# Altium project LV control.PrjPcb
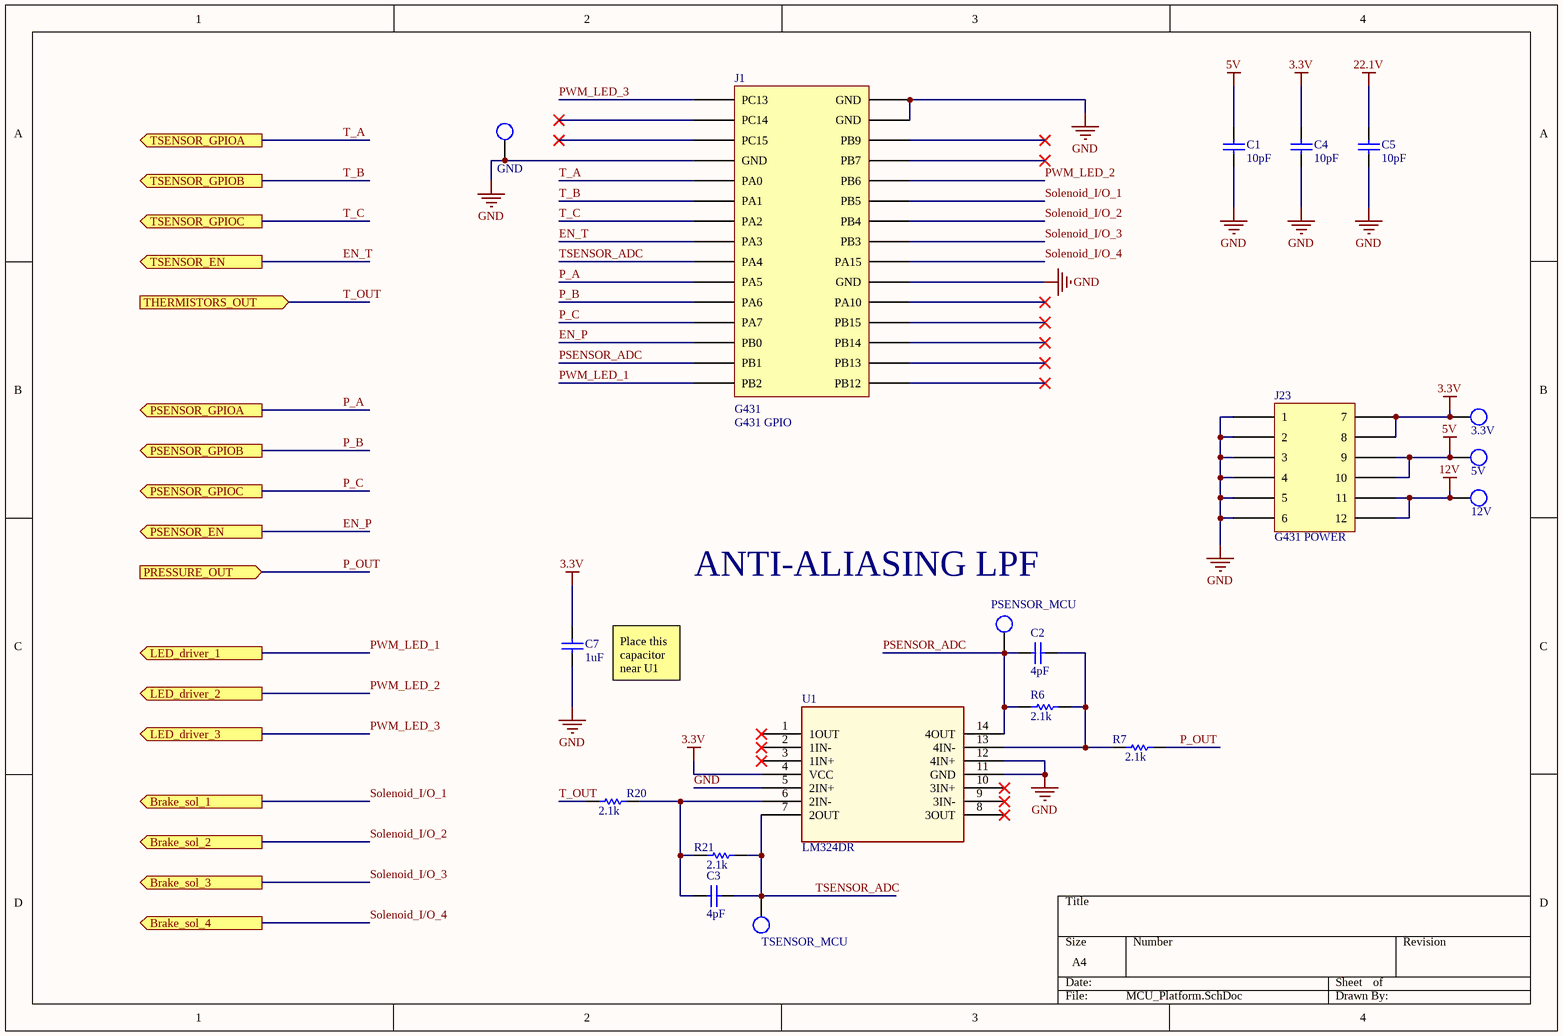
[diagram p0: MCU_Platform.SchDoc]
5 sheets, 71 parts. Net scope: flat (ports and power ports of the same name join across sheets).
Board file: LV control.PcbDoc
Sheets:
  MCU_Platform.SchDoc
  PressureSensors.SchDoc
  Thermistors.SchDoc
  LED_Driver.SchDoc
  Braking.SchDoc

## Sheet MCU_Platform.SchDoc
size A4; SheetNumber: 1; SheetTotal: 5

### Parts
3.3V  Test Point  [Test Point - 5002]  (value not drawn)  (no BOM)
5V  Test Point  [Test Point - 5002]  (value not drawn)  (no BOM)
12V  Test Point  [Test Point - 5002]  (value not drawn)  (no BOM)
C1  value 10pF  [0603 - Capacitor]  (hidden comment: Capacitor - Nonpolarized)
C2  value 4pF  [0603 - Capacitor]  (hidden comment: Capacitor - Nonpolarized)
C3  value 4pF  [0603 - Capacitor]  (hidden comment: Capacitor - Nonpolarized)
C4  value 10pF  [0603 - Capacitor]  (hidden comment: Capacitor - Nonpolarized)
C5  value 10pF  [0603 - Capacitor]  (hidden comment: Capacitor - Nonpolarized)
C7  value 1uF  [0603 - Capacitor]  (hidden comment: Capacitor - Nonpolarized)
GND  Test Point  [Test Point - 5002]  (value not drawn)  (no BOM)
J1  G431 GPIO  [G431 Header (GPIO Connector)]
J23  G431 POWER  [G431 HEADER (POWER CONNECTOR)]
PSENSOR_MCU  Test Point  [Test Point - 5002]  (value not drawn)  (no BOM)
R6  value 2.1k  [0805 - Resistor]  (hidden comment: Resistor)
R7  value 2.1k  [0805 - Resistor]  (hidden comment: Resistor)
R20  value 2.1k  [0805 - Resistor]  (hidden comment: Resistor)
R21  value 2.1k  [0805 - Resistor]  (hidden comment: Resistor)
TSENSOR_MCU  Test Point  [Test Point - 5002]  (value not drawn)  (no BOM)
U1  LM324DR  [LM324DR]

### Ports
Brake_sol_1 (out), Brake_sol_2 (out), Brake_sol_3 (out), Brake_sol_4 (out), LED_driver_1 (out), LED_driver_2 (out), LED_driver_3 (out), PRESSURE_OUT (in), PSENSOR_EN (out), PSENSOR_GPIOA (out), PSENSOR_GPIOB (out), PSENSOR_GPIOC (out), THERMISTORS_OUT (in), TSENSOR_EN (out), TSENSOR_GPIOA (out), TSENSOR_GPIOB (out), TSENSOR_GPIOC (out)

### Nets
3.3V: 3.3V.1 C4.2 C7.2 J23.7 J23.8 U1.4(VCC)
5V: 5V.1 C1.2 J23.9 J23.10
12V: 12V.1 J23.11 J23.12
22.1V: C5.2
GND: C1.1 C4.1 C5.1 C7.1 GND.1 J1.4(GND) J1.16(GND) J1.17(GND) J1.25(GND) J23.1 J23.2 J23.3 J23.4 J23.5 J23.6 U1.5(2IN+) U1.11(GND) U1.12(4IN+)
EN_P: J1.13(PB0) ; port PSENSOR_EN
EN_T: J1.8(PA3) ; port TSENSOR_EN
P_A: J1.10(PA5) ; port PSENSOR_GPIOA
P_B: J1.11(PA6) ; port PSENSOR_GPIOB
P_C: J1.12(PA7) ; port PSENSOR_GPIOC
P_OUT: R7.2 ; port PRESSURE_OUT
PSENSOR_ADC: C2.1 J1.14(PB1) PSENSOR_MCU.1 R6.1 U1.14(4OUT)
PWM_LED_1: J1.15(PB2) ; port LED_driver_1
PWM_LED_2: J1.20(PB6) ; port LED_driver_2
PWM_LED_3: J1.1(PC13) ; port LED_driver_3
Solenoid_I/O_1: J1.21(PB5) ; port Brake_sol_1  [project net SOL_MCU_1]
Solenoid_I/O_2: J1.22(PB4) ; port Brake_sol_2  [project net SOL_MCU_2]
Solenoid_I/O_3: J1.23(PB3) ; port Brake_sol_3  [project net SOL_MCU_3]
Solenoid_I/O_4: J1.24(PA15) ; port Brake_sol_4  [project net SOL_MCU_4]
T_A: J1.5(PA0) ; port TSENSOR_GPIOA
T_B: J1.6(PA1) ; port TSENSOR_GPIOB
T_C: J1.7(PA2) ; port TSENSOR_GPIOC
T_OUT: R20.1 ; port THERMISTORS_OUT
TSENSOR_ADC: C3.1 J1.9(PA4) R21.2 TSENSOR_MCU.1 U1.7(2OUT)
NetC2_2: C2.2 R6.2 R7.1 U1.13(4IN-)
NetC3_2: C3.2 R20.2 R21.1 U1.6(2IN-)

Not connected (* = marked no-connect by the designer): J1 2(PC14)* 3(PC15)* 18(PB9)* 19(PB7)* 26(PA10)* 27(PB15)* 28(PB14)* 29(PB13)* 30(PB12)*; U1 1(1OUT)* 2(1IN-)* 3(1IN+)* 8(3OUT)* 9(3IN-)* 10(3IN+)*

### Notes on the sheet
- ANTI-ALIASING LPF
- (near C7) Place this capacitor near U1
- (in symbol G431 GPIO) G431

### Library data of the parts
C1-C5 C7 = Capacitor - Nonpolarized: Nonpolarized Capacitor; Supplier Part Number: *; Supplier: *; Manufacturer: *; Rating: *; Manufacturer Part Number: *
J1 = G431 GPIO: PPPC152LJBN-RC (30 Position Header Connector 0.100" (2.54mm) Through Hole, Right Angle Gold); Manufacturer Name: Sullins Connector Solutions; Manufacturer Part Number (CONN): PPPC152LJBN-RC; Supplier Name: Digikey; Supplier Part Number: S5568-ND
J23 = G431 POWER: PPPC062LJBN-RC (12 Position Header Connector 0.100" (2.54mm) Through Hole, Right Angle Gold); Manufacturer Name: Sullins Connector Solutions; Manufacturer Part Number: PPPC062LJBN-RC; Supplier Name: Digikey; Supplier Part Number: S5559-ND
U1 = LM324DR: General Purpose Amplifier 4 Circuit 14-SOIC; Manufacturer Name: TI; Manufacturer Part Number: LM324DR; Supplier: Digikey; Supplier Part Number: 296-14597-2-ND
R6 R7 R20 R21 = Resistor: Rating: *; Manufacturer Part Number: *; Manufacturer: *; Supplier Part Number: *; Supplier: *

## Sheet PressureSensors.SchDoc
size A4; SheetNumber: 2; SheetTotal: 5
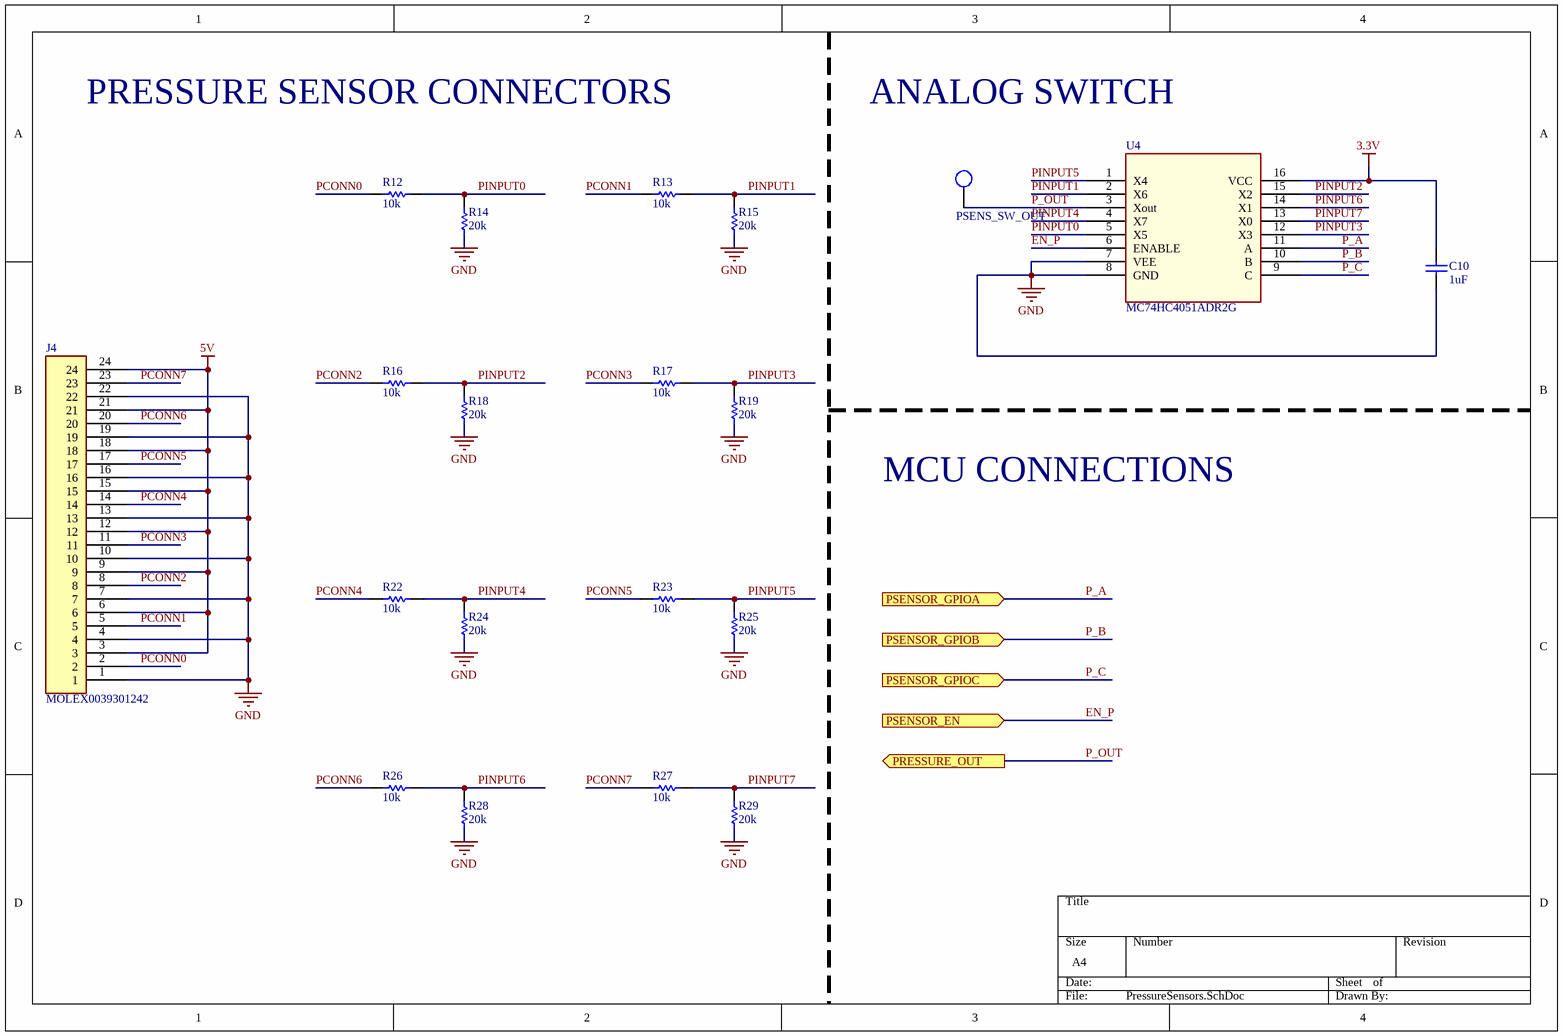
[diagram p1: PressureSensors.SchDoc]

### Parts
C10  value 1uF  [0603 - Capacitor]  (hidden comment: Capacitor - Nonpolarized)
J4  MOLEX0039301242  [MOLEX0039301242]
PSENS_SW_OUT  Test Point  [Test Point - 5002]  (value not drawn)  (no BOM)
R12  value 10k  [0805 - Resistor]  (hidden comment: Resistor)
R13  value 10k  [0805 - Resistor]  (hidden comment: Resistor)
R14  value 20k  [0805 - Resistor]  (hidden comment: Resistor)
R15  value 20k  [0805 - Resistor]  (hidden comment: Resistor)
R16  value 10k  [0805 - Resistor]  (hidden comment: Resistor)
R17  value 10k  [0805 - Resistor]  (hidden comment: Resistor)
R18  value 20k  [0805 - Resistor]  (hidden comment: Resistor)
R19  value 20k  [0805 - Resistor]  (hidden comment: Resistor)
R22  value 10k  [0805 - Resistor]  (hidden comment: Resistor)
R23  value 10k  [0805 - Resistor]  (hidden comment: Resistor)
R24  value 20k  [0805 - Resistor]  (hidden comment: Resistor)
R25  value 20k  [0805 - Resistor]  (hidden comment: Resistor)
R26  value 10k  [0805 - Resistor]  (hidden comment: Resistor)
R27  value 10k  [0805 - Resistor]  (hidden comment: Resistor)
R28  value 20k  [0805 - Resistor]  (hidden comment: Resistor)
R29  value 20k  [0805 - Resistor]  (hidden comment: Resistor)
U4  MC74HC4051ADR2G  [MC74HC4051ADR2G]

### Ports
PRESSURE_OUT (out), PSENSOR_EN (in), PSENSOR_GPIOA (in), PSENSOR_GPIOB (in), PSENSOR_GPIOC (in)

### Nets
3.3V: C10.2 U4.16(VCC)
5V: J4.3 J4.6 J4.9 J4.12 J4.15 J4.18 J4.21 J4.24
GND: C10.1 J4.1 J4.4 J4.7 J4.10 J4.13 J4.16 J4.19 J4.22 R14.1 R15.1 R18.1 R19.1 R24.1 R25.1 R28.1 R29.1 U4.7(VEE) U4.8(GND)
EN_P: U4.6(ENABLE) ; port PSENSOR_EN
P_A: U4.11(A) ; port PSENSOR_GPIOA
P_B: U4.10(B) ; port PSENSOR_GPIOB
P_C: U4.9(C) ; port PSENSOR_GPIOC
P_OUT: PSENS_SW_OUT.1 U4.3(Xout) ; port PRESSURE_OUT
PCONN0: J4.2 R12.1
PCONN1: J4.5 R13.1
PCONN2: J4.8 R16.1
PCONN3: J4.11 R17.1
PCONN4: J4.14 R22.1
PCONN5: J4.17 R23.1
PCONN6: J4.20 R26.1
PCONN7: J4.23 R27.1
PINPUT0: R12.2 R14.2 U4.5(X5)
PINPUT1: R13.2 R15.2 U4.2(X6)
PINPUT2: R16.2 R18.2 U4.15(X2)
PINPUT3: R17.2 R19.2 U4.12(X3)
PINPUT4: R22.2 R24.2 U4.4(X7)
PINPUT5: R23.2 R25.2 U4.1(X4)
PINPUT6: R26.2 R28.2 U4.14(X1)
PINPUT7: R27.2 R29.2 U4.13(X0)

### Notes on the sheet
- PRESSURE SENSOR CONNECTORS
- ANALOG SWITCH
- MCU CONNECTIONS

### Library data of the parts
C10 = Capacitor - Nonpolarized: Nonpolarized Capacitor; Supplier Part Number: *; Supplier: *; Manufacturer: *; Rating: *; Manufacturer Part Number: *
J4 = MOLEX0039301242: Connector Header Through Hole, Right Angle 24 position 0.165" (4.20mm); Manufacturer: Molex; Manufacturer Part Number: 0039301082; Supplier: DigiKey; Supplier Part Number: WM21366-ND; ComponentLink1Description: Datasheet; ComponentLink1URL: https://www.molex.com/pdm_docs/sd/039301082_sd.pdf
U4 = MC74HC4051ADR2G: 1 Circuit IC Switch 8:1 100Ohm 16-SOIC; Manufacturer Name: onsemi; Manufacturer Part Number: MC74HC4051ADR2G; Supplier Name: Digikey; Supplier Part Number: MC74HC4051ADR2GOSTR-ND
R12-R19 R22-R29 = Resistor: Rating: *; Manufacturer Part Number: *; Manufacturer: *; Supplier Part Number: *; Supplier: *

## Sheet Thermistors.SchDoc
size A4; SheetNumber: 3; SheetTotal: 5
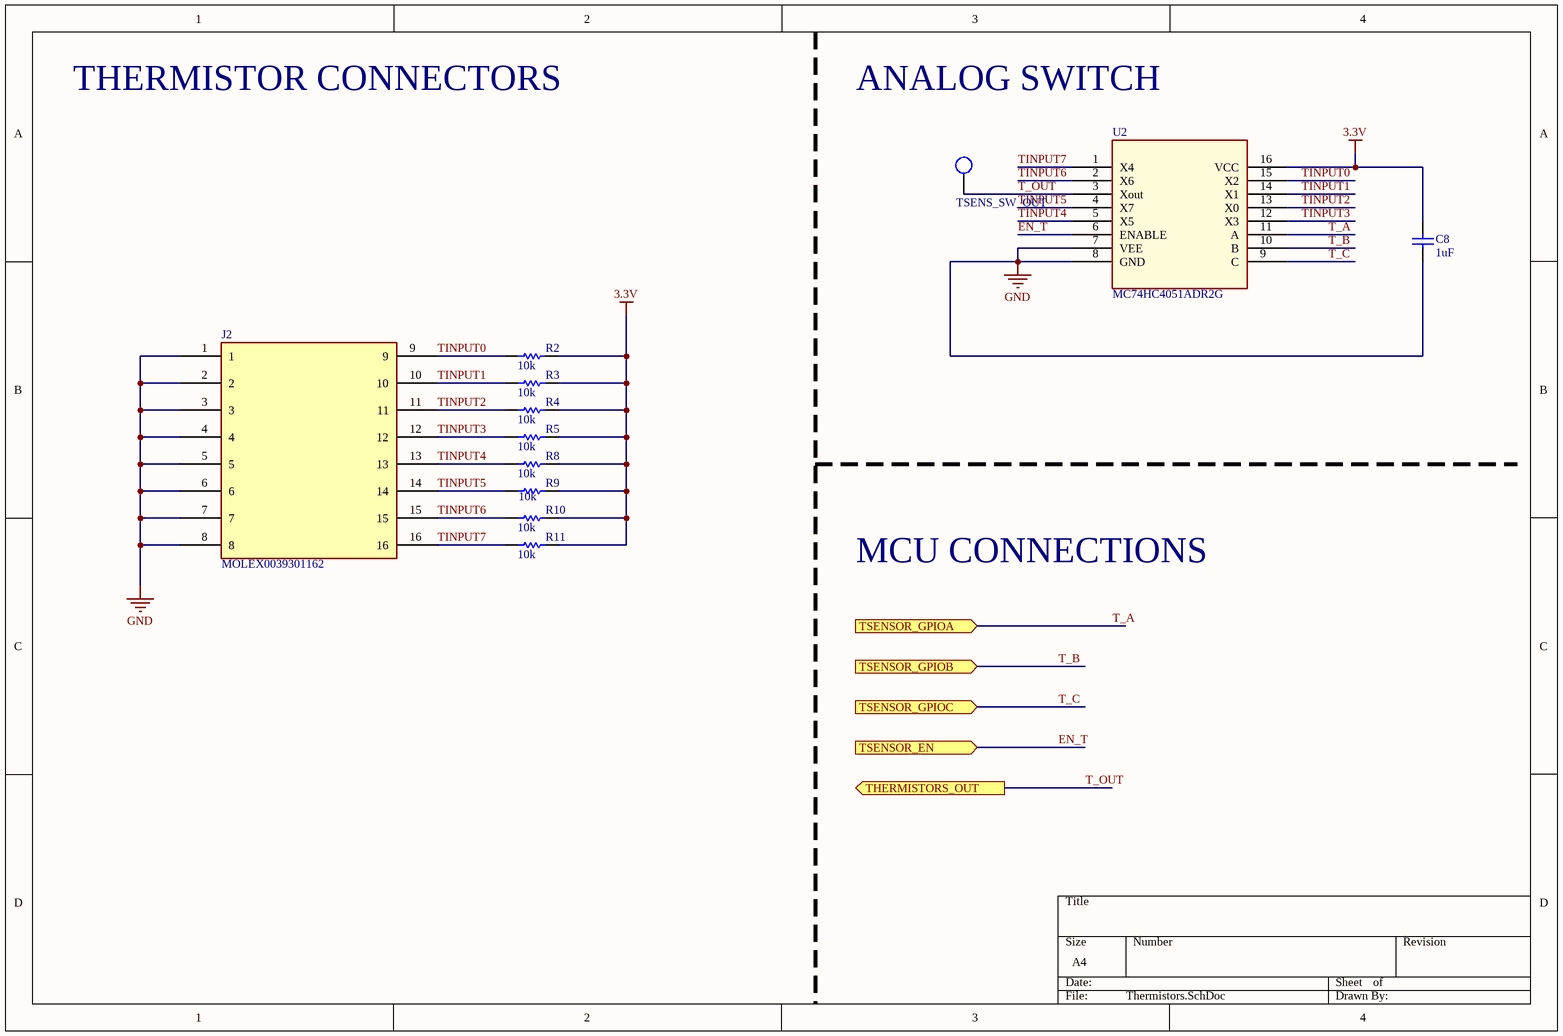
[diagram p2: Thermistors.SchDoc]

### Parts
C8  value 1uF  [0603 - Capacitor]  (hidden comment: Capacitor - Nonpolarized)
J2  MOLEX0039301162  [MOLEX0039301162]
R2  value 10k  [0805 - Resistor]  (hidden comment: Resistor)
R3  value 10k  [0805 - Resistor]  (hidden comment: Resistor)
R4  value 10k  [0805 - Resistor]  (hidden comment: Resistor)
R5  value 10k  [0805 - Resistor]  (hidden comment: Resistor)
R8  value 10k  [0805 - Resistor]  (hidden comment: Resistor)
R9  value 10k  [0805 - Resistor]  (hidden comment: Resistor)
R10  value 10k  [0805 - Resistor]  (hidden comment: Resistor)
R11  value 10k  [0805 - Resistor]  (hidden comment: Resistor)
TSENS_SW_OUT  Test Point  [Test Point - 5002]  (value not drawn)  (no BOM)
U2  MC74HC4051ADR2G  [MC74HC4051ADR2G]

### Ports
THERMISTORS_OUT (out), TSENSOR_EN (in), TSENSOR_GPIOA (in), TSENSOR_GPIOB (in), TSENSOR_GPIOC (in)

### Nets
3.3V: C8.2 R2.1 R3.1 R4.1 R5.1 R8.1 R9.1 R10.1 R11.1 U2.16(VCC)
GND: C8.1 J2.1 J2.2 J2.3 J2.4 J2.5 J2.6 J2.7 J2.8 U2.7(VEE) U2.8(GND)
EN_T: U2.6(ENABLE) ; port TSENSOR_EN
T_A: U2.11(A) ; port TSENSOR_GPIOA
T_B: U2.10(B) ; port TSENSOR_GPIOB
T_C: U2.9(C) ; port TSENSOR_GPIOC
T_OUT: TSENS_SW_OUT.1 U2.3(Xout) ; port THERMISTORS_OUT
TINPUT0: J2.9 R2.2 U2.15(X2)
TINPUT1: J2.10 R3.2 U2.14(X1)
TINPUT2: J2.11 R4.2 U2.13(X0)
TINPUT3: J2.12 R5.2 U2.12(X3)
TINPUT4: J2.13 R8.2 U2.5(X5)
TINPUT5: J2.14 R9.2 U2.4(X7)
TINPUT6: J2.15 R10.2 U2.2(X6)
TINPUT7: J2.16 R11.2 U2.1(X4)

### Notes on the sheet
- THERMISTOR CONNECTORS
- ANALOG SWITCH
- MCU CONNECTIONS

### Library data of the parts
C8 = Capacitor - Nonpolarized: Nonpolarized Capacitor; Supplier Part Number: *; Supplier: *; Manufacturer: *; Rating: *; Manufacturer Part Number: *
J2 = MOLEX0039301162: Connector Header Through Hole, Right Angle 16 position 0.165" (4.20mm); Manufacturer: Molex; Manufacturer Part Number: 0039301082; Supplier: DigiKey; Supplier Part Number: WM21366-ND; ComponentLink1Description: Datasheet; ComponentLink1URL: https://www.molex.com/pdm_docs/sd/039301082_sd.pdf
U2 = MC74HC4051ADR2G: as U4 on sheet PressureSensors; Manufacturer Part Number: MC74HC4051ADR2G; Supplier Name: Digikey; Supplier Part Number: MC74HC4051ADR2GOSTR-ND
R2-R5 R8-R11 = Resistor: Rating: *; Manufacturer Part Number: *; Manufacturer: *; Supplier Part Number: *; Supplier: *

## Sheet LED_Driver.SchDoc
size A4; SheetNumber: 4; SheetTotal: 5
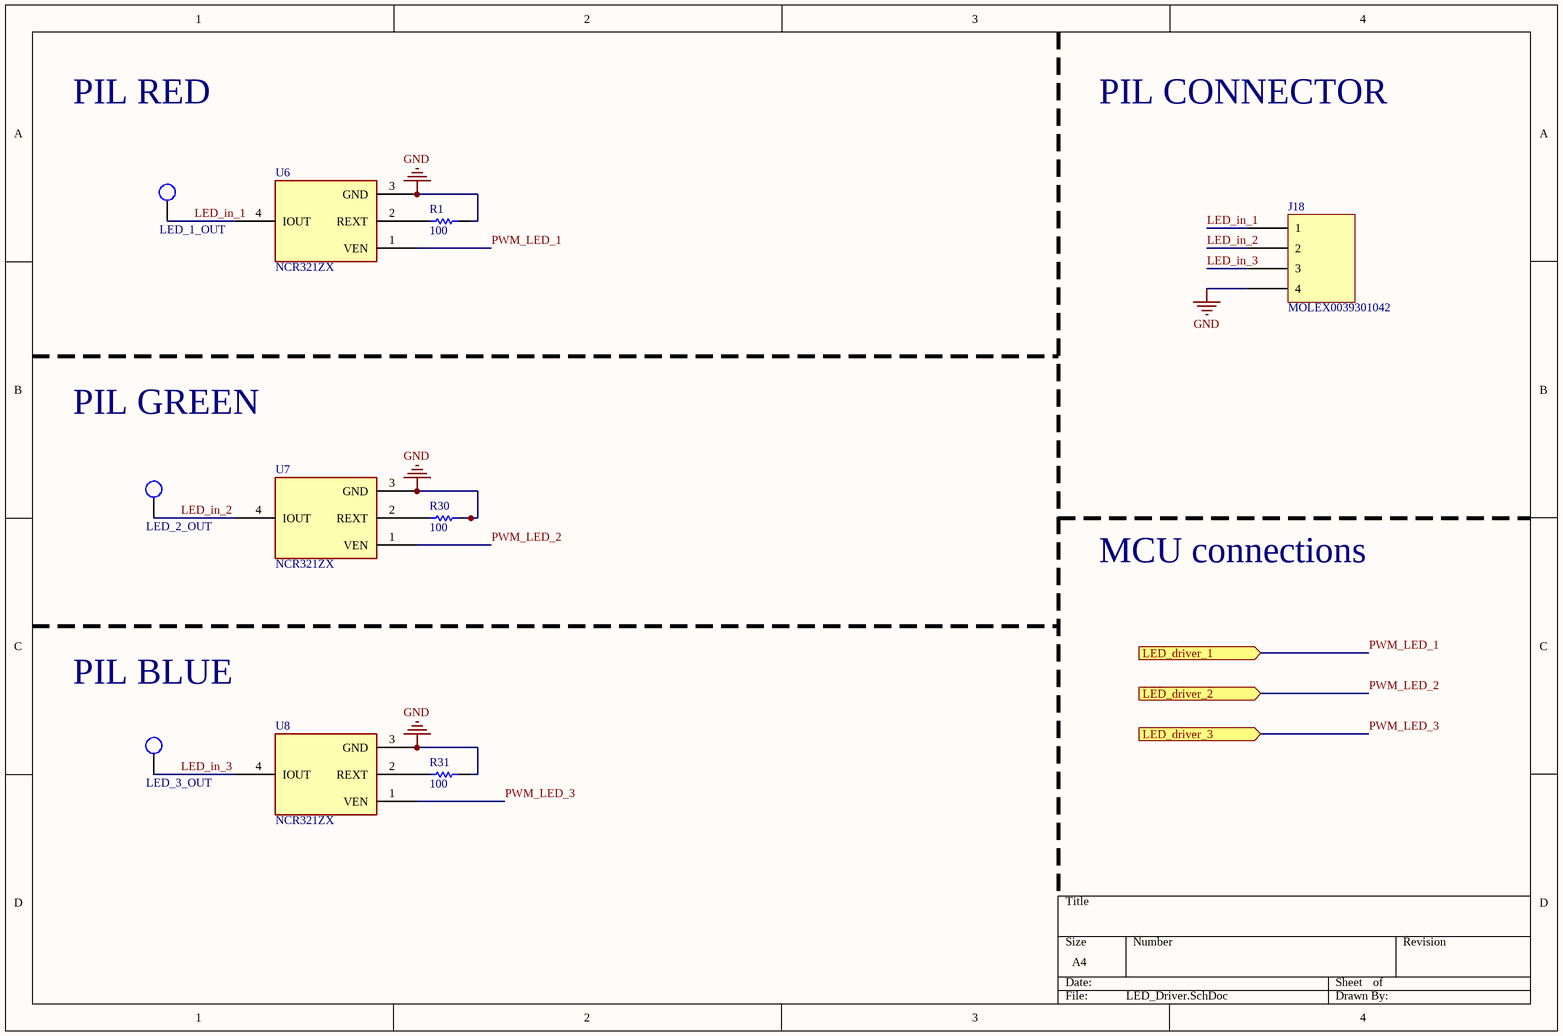
[diagram p3: LED_Driver.SchDoc]

### Parts
J18  MOLEX0039301042  [MOLEX0039301042]
LED_1_OUT  Test Point  [Test Point - 5002]  (value not drawn)  (no BOM)
LED_2_OUT  Test Point  [Test Point - 5002]  (value not drawn)  (no BOM)
LED_3_OUT  Test Point  [Test Point - 5002]  (value not drawn)  (no BOM)
R1  value 100  [0805 - Resistor]  (hidden comment: Resistor)
R30  value 100  [0805 - Resistor]  (hidden comment: Resistor)
R31  value 100  [0805 - Resistor]  (hidden comment: Resistor)
U6  NCR321ZX  [NCR321ZX LED driver]
U7  NCR321ZX  [NCR321ZX LED driver]
U8  NCR321ZX  [NCR321ZX LED driver]

### Ports
LED_driver_1 (in), LED_driver_2 (in), LED_driver_3 (in)

### Nets
GND: J18.4 R1.2 R30.2 R31.2 U6.3(GND) U7.3(GND) U8.3(GND)
LED_in_1: J18.1 LED_1_OUT.1 U6.4(IOUT)
LED_in_2: J18.2 LED_2_OUT.1 U7.4(IOUT)
LED_in_3: J18.3 LED_3_OUT.1 U8.4(IOUT)
PWM_LED_1: U6.1(VEN) ; port LED_driver_1
PWM_LED_2: U7.1(VEN) ; port LED_driver_2
PWM_LED_3: U8.1(VEN) ; port LED_driver_3
NetR1_1: R1.1 U6.2(REXT)
NetR30_1: R30.1 U7.2(REXT)
NetR31_1: R31.1 U8.2(REXT)

### Notes on the sheet
- PIL RED
- PIL CONNECTOR
- PIL GREEN
- MCU connections
- PIL BLUE

### Library data of the parts
J18 = MOLEX0039301042: Connector Header Through Hole, Right Angle 4 position 0.165" (4.20mm); Manufacturer: Molex; Manufacturer Part Number: 0039301042; Supplier: Digikey; Supplier Part Number: WM21364-ND; ComponentLink1Description: Datasheet; ComponentLink1URL: https://www.molex.com/pdm_docs/sd/039301042_sd.pdf
U6-U8 = NCR321ZX: IC LED DRVR LIN PWM 250MA SOT223; Manufacturer name: Nexperia USA Inc.; Supplier 1: Digikey; ComponentLink1Description: Datasheet; ComponentLink1URL: https://assets.nexperia.com/documents/data-sheet/NCR320Z_NCR321Z.pdf; Supplier part number: 1727-8461-2-ND; Manufacturer part number: NCR321ZX
R1 R30 R31 = Resistor: Rating: *; Manufacturer Part Number: *; Manufacturer: *; Supplier Part Number: *; Supplier: *

## Sheet Braking.SchDoc
size A4; SheetNumber: 5; SheetTotal: 5
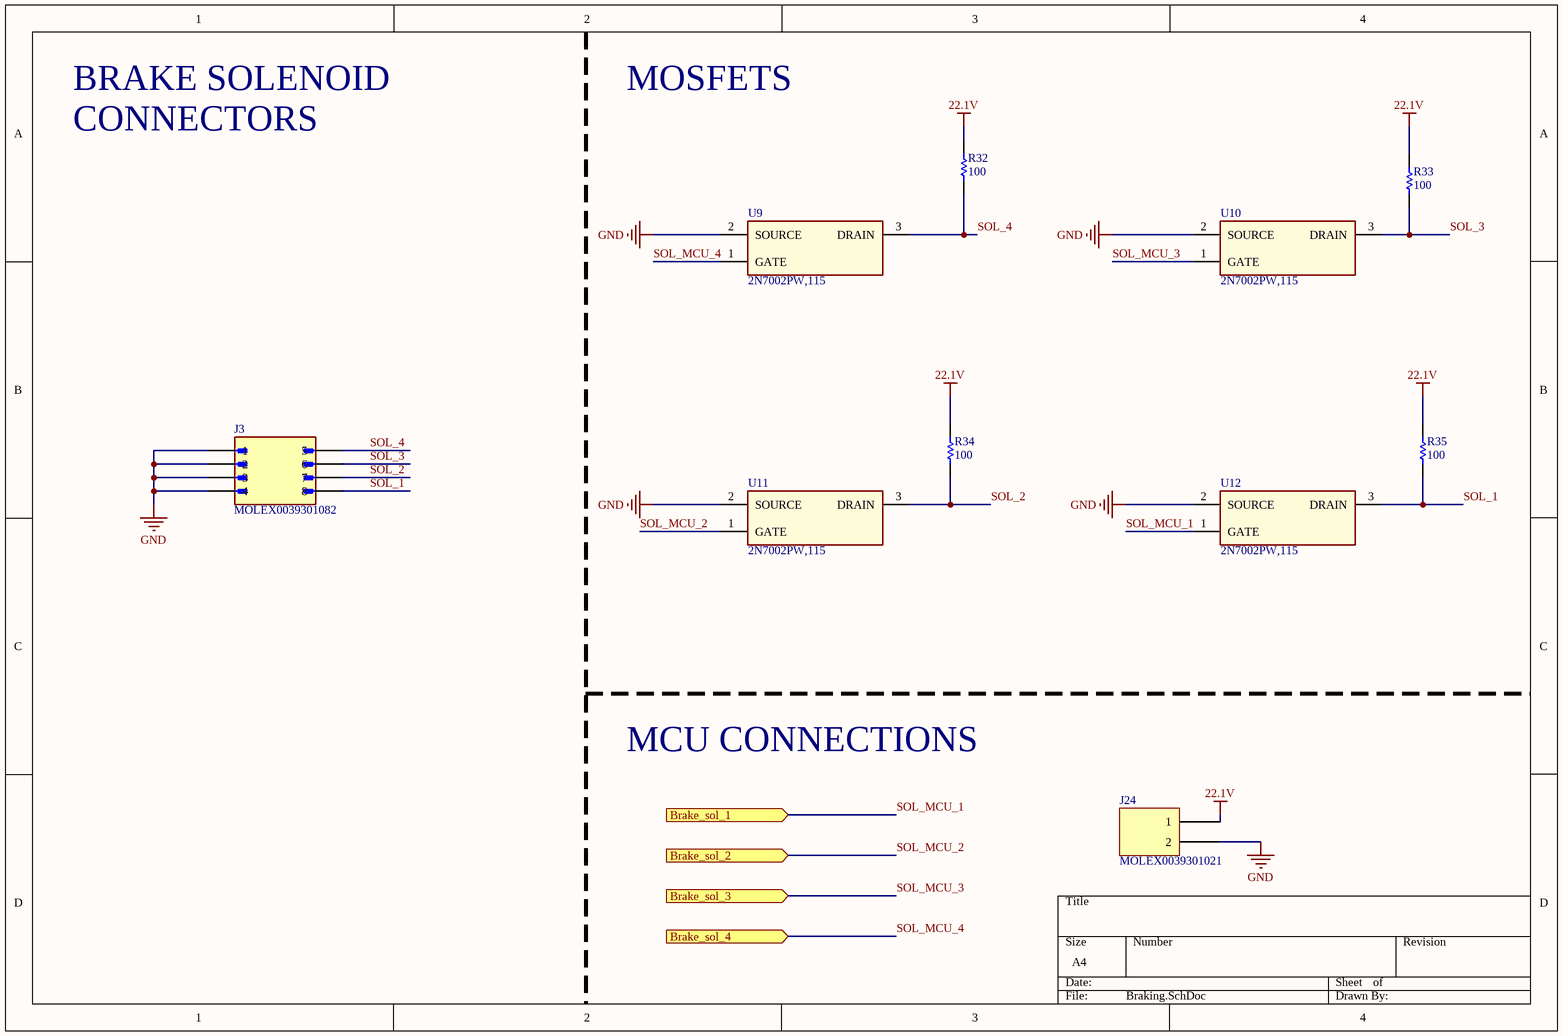
[diagram p4: Braking.SchDoc]

### Parts
J3  MOLEX0039301082  [MOLEX0039301082]
J24  MOLEX0039301021  [MOLEX0039301021]
R32  value 100  [0805 - Resistor]  (hidden comment: Resistor)
R33  value 100  [0805 - Resistor]  (hidden comment: Resistor)
R34  value 100  [0805 - Resistor]  (hidden comment: Resistor)
R35  value 100  [0805 - Resistor]  (hidden comment: Resistor)
U9  2N7002PW,115  [SOT65P210X110-3N]
U10  2N7002PW,115  [SOT65P210X110-3N]
U11  2N7002PW,115  [SOT65P210X110-3N]
U12  2N7002PW,115  [SOT65P210X110-3N]

### Ports
Brake_sol_1 (in), Brake_sol_2 (in), Brake_sol_3 (in), Brake_sol_4 (in)

### Nets
22.1V: J24.1 R32.2 R33.2 R34.2 R35.2
GND: J3.1 J3.2 J3.3 J3.4 J24.2 U9.2(SOURCE) U10.2(SOURCE) U11.2(SOURCE) U12.2(SOURCE)
SOL_1: J3.8 R35.1 U12.3(DRAIN)
SOL_2: J3.7 R34.1 U11.3(DRAIN)
SOL_3: J3.6 R33.1 U10.3(DRAIN)
SOL_4: J3.5 R32.1 U9.3(DRAIN)
SOL_MCU_1: U12.1(GATE) ; port Brake_sol_1
SOL_MCU_2: U11.1(GATE) ; port Brake_sol_2
SOL_MCU_3: U10.1(GATE) ; port Brake_sol_3
SOL_MCU_4: U9.1(GATE) ; port Brake_sol_4

### Notes on the sheet
- BRAKE SOLENOID
- MOSFETS
- CONNECTORS
- MCU CONNECTIONS

### Library data of the parts
J3 = MOLEX0039301082: Connector Header Through Hole, Right Angle 8 position 0.165" (4.20mm); Manufacturer: Molex; Manufacturer Part Number: 0039301082; Supplier: DigiKey; Supplier Part Number: WM21366-ND; ComponentLink1Description: Datasheet; ComponentLink1URL: https://www.molex.com/pdm_docs/sd/039301082_sd.pdf
J24 = MOLEX0039301021: Connector Header Through Hole, Right Angle 2 pin 0.165" (4.20mm)
U9-U12 = 2N7002PW,115: N-Channel 60V 310mA (Ta) 260mW (Ta) Surface Mount SOT-323; MF: Nexperia USA; SnapEDA_Link: https://www.snapeda.com/parts/2N7002PW,115/Nexperia%20USA%20Inc./view-part/2152859/?ref=snap; MP: 2N7002PW,115; Value: *; Digi-Key_Part_Number: 1727-4793-1-ND; Package: SOT-323 Nexperia; ComponentLink1Description: Manufacturer name; ComponentLink1URL: *Nexperia USA Inc.; ComponentLink2Description: Manufacturer part number; ComponentLink2URL: PMF370XN,115; ComponentLink3Description: Supplier name; ComponentLink3URL: Digikey; ComponentLink4Description: Supplier part #; ComponentLink4URL: 1727-5422-2-ND
R32-R35 = Resistor: Rating: *; Manufacturer Part Number: *; Manufacturer: *; Supplier Part Number: *; Supplier: *

## Nets that join several sheets
3.3V: MCU_Platform (6 pins), PressureSensors (C10.2 U4.16), Thermistors (10 pins)
5V: MCU_Platform (5V.1 C1.2 J23.9 J23.10), PressureSensors (8 pins)
22.1V: MCU_Platform (C5.2), Braking (5 pins)
GND: MCU_Platform (18 pins), PressureSensors (19 pins), Thermistors (11 pins), LED_Driver (7 pins), Braking (9 pins)
EN_P: MCU_Platform (J1.13), PressureSensors (U4.6)
EN_T: MCU_Platform (J1.8), Thermistors (U2.6)
P_A: MCU_Platform (J1.10), PressureSensors (U4.11)
P_B: MCU_Platform (J1.11), PressureSensors (U4.10)
P_C: MCU_Platform (J1.12), PressureSensors (U4.9)
P_OUT: MCU_Platform (R7.2), PressureSensors (PSENS_SW_OUT.1 U4.3)
PWM_LED_1: MCU_Platform (J1.15), LED_Driver (U6.1)
PWM_LED_2: MCU_Platform (J1.20), LED_Driver (U7.1)
PWM_LED_3: MCU_Platform (J1.1), LED_Driver (U8.1)
SOL_MCU_1: MCU_Platform (J1.21), Braking (U12.1)
SOL_MCU_2: MCU_Platform (J1.22), Braking (U11.1)
SOL_MCU_3: MCU_Platform (J1.23), Braking (U10.1)
SOL_MCU_4: MCU_Platform (J1.24), Braking (U9.1)
T_A: MCU_Platform (J1.5), Thermistors (U2.11)
T_B: MCU_Platform (J1.6), Thermistors (U2.10)
T_C: MCU_Platform (J1.7), Thermistors (U2.9)
T_OUT: MCU_Platform (R20.1), Thermistors (TSENS_SW_OUT.1 U2.3)